# Altium schematic sheet Connectors.SchDoc
size A3; SheetNumber: 3; SheetTotal: 9
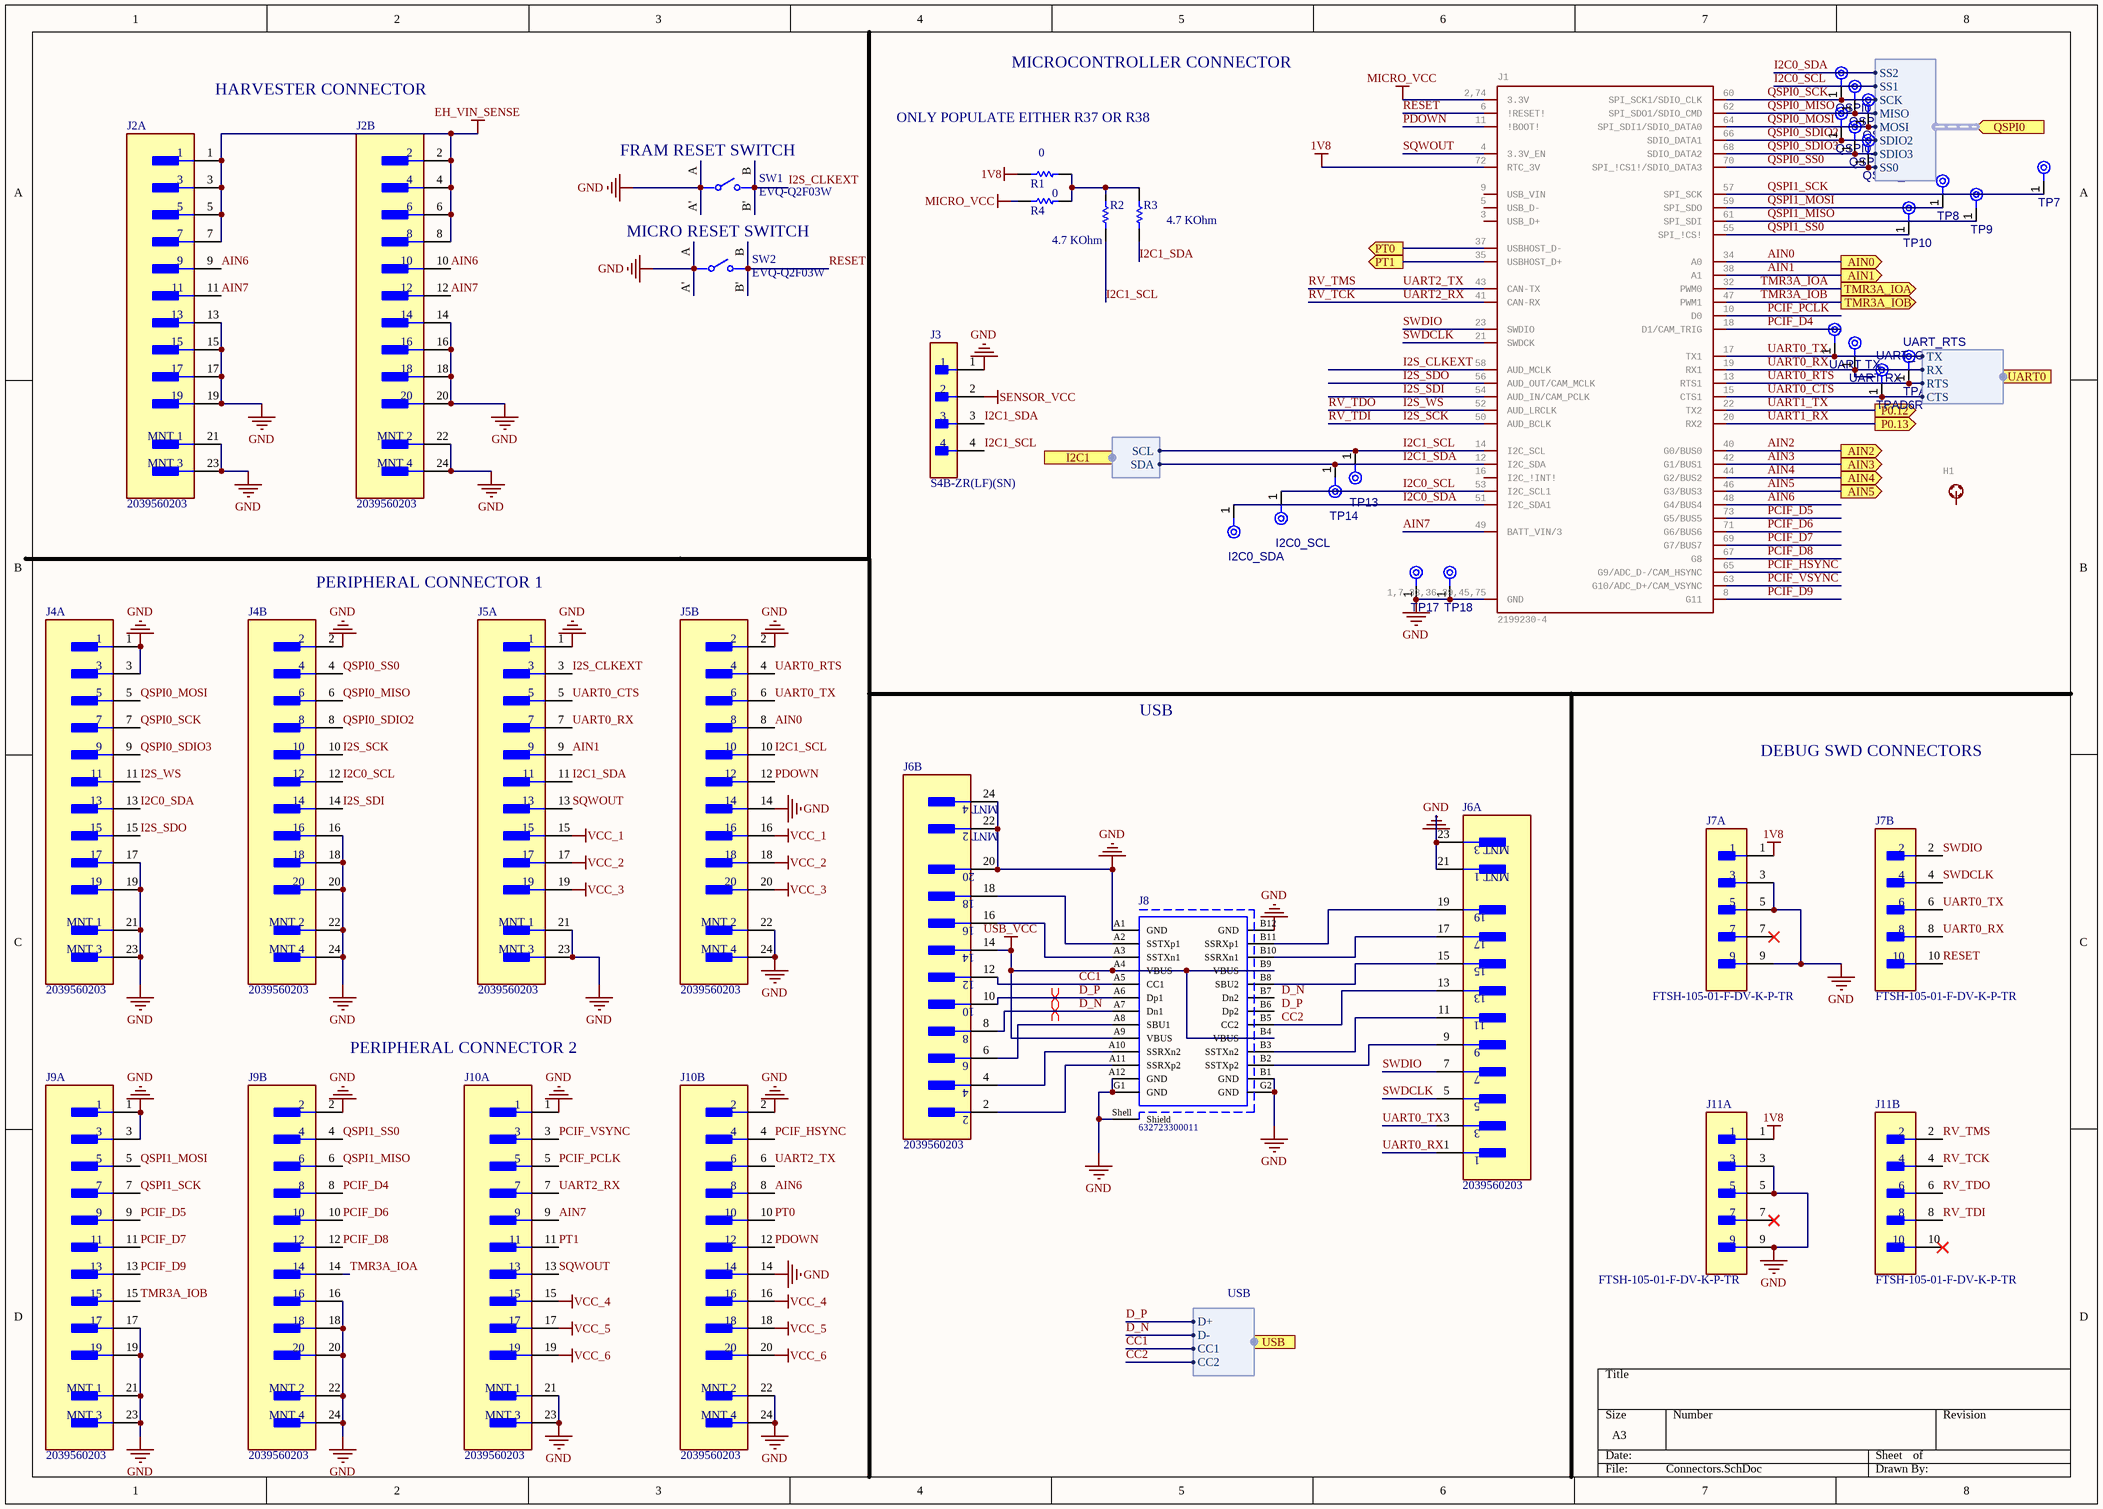
[diagram p0: Connectors.SchDoc]

## Parts
H1  9774025151R  [STAND-OFF-REFLOW-M2-5]  (value not drawn)
I2C0_SCL  TPAD6R  [TP06R]  (value not drawn)  (no BOM)
I2C0_SDA  TPAD6R  [TP06R]  (value not drawn)  (no BOM)
J1  2199230-4  [M-2-CONNECTOR-E]
J2  2039560203  [Molex_0_MFG]  (parts A,B of 2)
J3  S4B-ZR(LF)(SN)  [FP-S4B-ZR_LF_SN-MFG]
J4  2039560203  [Molex_0_MFG]  (parts A,B of 2)
J5  2039560203  [Molex_0_MFG]  (parts A,B of 2)
J6  2039560203  [Molex_0_MFG]  (parts A,B of 2)
J7  FTSH-105-01-F-DV-K-P-TR  [FP-FTSH-105-01-F-DV-K-P-T-MFG]  (parts A,B of 2)
J8  632723300011  [632723300011]
J9  2039560203  [Molex_0_MFG]  (parts A,B of 2)
J10  2039560203  [Molex_0_MFG]  (parts A,B of 2)
J11  FTSH-105-01-F-DV-K-P-TR  [FP-FTSH-105-01-F-DV-K-P-T-MFG]  (parts A,B of 2)
QSPI0_MISO  TPAD6R  [TP06R]  (value not drawn)  (no BOM)
QSPI0_MOSI  TPAD6R  [TP06R]  (value not drawn)  (no BOM)
QSPI0_SCK  TPAD6R  [TP06R]  (value not drawn)  (no BOM)
QSPI0_SDIO2  TPAD6R  [TP06R]  (value not drawn)  (no BOM)
QSPI0_SDIO3  TPAD6R  [TP06R]  (value not drawn)  (no BOM)
QSPI0_SS0  TPAD6R  [TP06R]  (value not drawn)  (no BOM)
R1  Resistance: 0  [RESC1005X40X25NL05T10]  (hidden comment: RC0402JR-070RL)
R2  Resistance: 4.7 KOhm  [RESC1005X40X25ML05T05]  (hidden comment: RMCF0402JT4K70)
R3  Resistance: 4.7 KOhm  [RESC1005X40X25ML05T05]  (hidden comment: RMCF0402JT4K70)
R4  Resistance: 0  [RESC1005X40X25NL05T10]  (hidden comment: RC0402JR-070RL)
SW1  EVQ-Q2F03W  [FP-EVQ-Q2F03W-MFG]
SW2  EVQ-Q2F03W  [FP-EVQ-Q2F03W-MFG]
TP7  TPAD6R  [TP06R]  (value not drawn)  (no BOM)
TP8  TPAD6R  [TP06R]  (value not drawn)  (no BOM)
TP9  TPAD6R  [TP06R]  (value not drawn)  (no BOM)
TP10  TPAD6R  [TP06R]  (value not drawn)  (no BOM)
TP13  TPAD6R  [TP06R]  (value not drawn)  (no BOM)
TP14  TPAD6R  [TP06R]  (value not drawn)  (no BOM)
TP17  TPAD6R  [TP06R]  (value not drawn)  (no BOM)
TP18  TPAD6R  [TP06R]  (value not drawn)  (no BOM)
UART_CTS  TPAD6R  [TP06R]  (no BOM)
UART_RTS  TPAD6R  [TP06R]  (no BOM)
UART_RX  TPAD6R  [TP06R]  (value not drawn)  (no BOM)
UART_TX  TPAD6R  [TP06R]  (value not drawn)  (no BOM)

## Ports
AIN0 (out), AIN1 (out), AIN2 (out), AIN3 (out), AIN4 (out), AIN5 (out), I2C1 (in, harness I2C1), P0.12 (out), P0.13 (out), PT0 (out), PT1 (out), QSPI0 (in, harness QSPI0), TMR3A_IOA (out), TMR3A_IOB (out), UART0 (out, harness *), USB (out, harness USB)

## Harnesses
QSPI0: SCK, MISO, MOSI, SDIO2, SDIO3, SS0, SS1, SS2
I2C1: SCL, SDA
*: TX, RX, RTS, CTS
USB: D+, D-, CC1, CC2

## Nets
1V8: J1.72(RTC_3V) J7.1 J11.1 R1.1
EH_VIN_SENSE: J2.1 J2.2 J2.3 J2.4 J2.5 J2.6 J2.7 J2.8
GND: J1.1,7,33,36,39,45,75(GND) J2.13 J2.14 J2.15 J2.16 J2.17 J2.18 J2.19 J2.20 J2.21(MNT_1) J2.22(MNT_2) J2.23(MNT_3) J2.24(MNT_4) J3.1 J4.1 J4.2 J4.3 J4.16 J4.17 J4.18 J4.19 J4.20 J4.21(MNT_1) J4.22(MNT_2) J4.23(MNT_3) J4.24(MNT_4) J5.1 J5.2 J5.14 J5.21(MNT_1) J5.22(MNT_2) J5.23(MNT_3) J5.24(MNT_4) J6.20 J6.21(MNT_1) J6.22(MNT_2) J6.23(MNT_3) J6.24(MNT_4) J7.3 J7.5 J7.9 J8.A1(GND) J8.A12(GND) J8.B1(GND) J8.B12(GND) J8.G1(GND) J8.G2(GND) J8.Shell(Shield) J9.1 J9.2 J9.3 J9.16 J9.17 J9.18 J9.19 J9.20 J9.21(MNT_1) J9.22(MNT_2) J9.23(MNT_3) J9.24(MNT_4) J10.1 J10.2 J10.14 J10.21(MNT_1) J10.22(MNT_2) J10.23(MNT_3) J10.24(MNT_4) J11.3 J11.5 J11.9 SW1.A SW1.A' SW2.A SW2.A' TP17.1(TP) TP18.1(TP)
MICRO_VCC: J1.2,74(3.3V) R4.1
SENSOR_VCC: J3.2
USB_VCC: J6.14 J8.A4(VBUS) J8.A9(VBUS) J8.B4(VBUS) J8.B9(VBUS)
VCC_1: J5.15 J5.16
VCC_2: J5.17 J5.18
VCC_3: J5.19 J5.20
VCC_4: J10.15 J10.16
VCC_5: J10.17 J10.18
VCC_6: J10.19 J10.20
AIN0: J1.34(A0) J5.8 ; port AIN0
AIN1: J1.38(A1) J5.9 ; port AIN1
AIN2: J1.40(G0/BUS0) ; port AIN2
AIN3: J1.42(G1/BUS1) ; port AIN3
AIN4: J1.44(G2/BUS2) ; port AIN4
AIN5: J1.46(G3/BUS3) ; port AIN5
AIN6: J1.48(G4/BUS4) J2.9 J2.10 J10.8
AIN7: J1.49(BATT_VIN/3) J2.11 J2.12 J10.9
CC1: J6.12 J8.A5(CC1) ; port USB.CC1
CC2: J6.13 J8.B5(CC2) ; port USB.CC2
D_N: J6.8 J8.A7(Dn1) ; port USB.D-
D_P: J6.10 J8.A6(Dp1) ; port USB.D+
I2C0_SCL: I2C0_SCL.1(TP) J1.53(I2C_SCL1) J4.12 ; port QSPI0.SS1
I2C0_SDA: I2C0_SDA.1(TP) J1.51(I2C_SDA1) J4.13 ; port QSPI0.SS2
I2C1_SCL: J1.14(I2C_SCL) J3.4 J5.10 R2.1 TP13.1(TP) ; port I2C1.SCL
I2C1_SDA: J1.12(I2C_SDA) J3.3 J5.11 R3.1 TP14.1(TP) ; port I2C1.SDA
I2S_CLKEXT: J1.58(AUD_MCLK) J5.3 SW1.B SW1.B'
I2S_SCK: J1.50(AUD_BCLK) J4.10 J11.8  [also labelled RV_TDI]
I2S_SDI: J1.54(AUD_IN/CAM_PCLK) J4.14
I2S_SDO: J1.56(AUD_OUT/CAM_MCLK) J4.15
I2S_WS: J1.52(AUD_LRCLK) J4.11 J11.6  [also labelled RV_TDO]
PCIF_D4: J1.18(D1/CAM_TRIG) J9.8
PCIF_D5: J1.73(G5/BUS5) J9.9
PCIF_D6: J1.71(G6/BUS6) J9.10
PCIF_D7: J1.69(G7/BUS7) J9.11
PCIF_D8: J1.67(G8) J9.12
PCIF_D9: J1.8(G11) J9.13
PCIF_HSYNC: J1.65(G9/ADC_D-/CAM_HSYNC) J10.4
PCIF_PCLK: J1.10(D0) J10.5
PCIF_VSYNC: J1.63(G10/ADC_D+/CAM_VSYNC) J10.3
PDOWN: J1.11(!BOOT!) J5.12 J10.12
PT0: J10.10
PT0: J1.37(USBHOST_D-) ; port PT0  [a separate net that carries the same name]
PT1: J10.11
PT1: J1.35(USBHOST_D+) ; port PT1  [a separate net that carries the same name]
QSPI0_MISO: J1.62(SPI_SDO1/SDIO_CMD) J4.6 QSPI0_MISO.1(TP) ; port QSPI0.MISO
QSPI0_MOSI: J1.64(SPI_SDI1/SDIO_DATA0) J4.5 QSPI0_MOSI.1(TP) ; port QSPI0.MOSI
QSPI0_SCK: J1.60(SPI_SCK1/SDIO_CLK) J4.7 QSPI0_SCK.1(TP) ; port QSPI0.SCK
QSPI0_SDIO2: J1.66(SDIO_DATA1) J4.8 QSPI0_SDIO2.1(TP) ; port QSPI0.SDIO2
QSPI0_SDIO3: J1.68(SDIO_DATA2) J4.9 QSPI0_SDIO3.1(TP) ; port QSPI0.SDIO3
QSPI0_SS0: J1.70(SPI_!CS1!/SDIO_DATA3) J4.4 QSPI0_SS0.1(TP) ; port QSPI0.SS0
QSPI1_MISO: J1.61(SPI_SDI) J9.6 TP9.1(TP)
QSPI1_MOSI: J1.59(SPI_SDO) J9.5 TP8.1(TP)
QSPI1_SCK: J1.57(SPI_SCK) J9.7 TP7.1(TP)
QSPI1_SS0: J1.55(SPI_!CS!) J9.4 TP10.1(TP)
RESET: J1.6(!RESET!) J7.10 SW2.B SW2.B'
RV_TCK: J1.41(CAN-RX) J10.7 J11.4  [also labelled UART2_RX]
RV_TMS: J1.43(CAN-TX) J10.6 J11.2  [also labelled UART2_TX]
SQWOUT: J1.4(3.3V_EN) J5.13 J10.13
SWDCLK: J1.21(SWDCK) J6.5 J7.4
SWDIO: J1.23(SWDIO) J6.7 J7.2
TMR3A_IOA: J1.32(PWM0) J9.14 ; port TMR3A_IOA
TMR3A_IOB: J1.47(PWM1) J9.15 ; port TMR3A_IOB
UART0_CTS: J1.15(CTS1) J5.5 UART_CTS.1(TP) ; port UART0.CTS
UART0_RTS: J1.13(RTS1) J5.4 UART_RTS.1(TP) ; port UART0.RTS
UART0_RX: J1.19(RX1) J5.7 J6.1 J7.8 UART_RX.1(TP) ; port UART0.RX
UART0_TX: J1.17(TX1) J5.6 J6.3 J7.6 UART_TX.1(TP) ; port UART0.TX
UART1_RX: J1.20(RX2) ; port P0.13
UART1_TX: J1.22(TX2) ; port P0.12
NetJ6_2: J6.2 J8.A11(SSRXp2)
NetJ6_4: J6.4 J8.A10(SSRXn2)
NetJ6_6: J6.6 J8.A8(SBU1)
NetJ6_9: J6.9 J8.B2(SSTXp2)
NetJ6_11: J6.11 J8.B3(SSTXn2)
NetJ6_15: J6.15 J8.B8(SBU2)
NetJ6_16: J6.16 J8.A3(SSTXn1)
NetJ6_17: J6.17 J8.B10(SSRXn1)
NetJ6_18: J6.18 J8.A2(SSTXp1)
NetJ6_19: J6.19 J8.B11(SSRXp1)
NetR1_2: R1.2 R2.2 R3.2 R4.2

Not connected (* = marked no-connect by the designer): H1 1; J1 3(USB_D+) 5(USB_D-) 9(USB_VIN) 16(I2C_!INT!); J7 7*; J8 B6(Dp2) B7(Dn2); J11 7* 10*

## Layout directives
differential pair: D_N, D_P

## Notes on the sheet
- HARVESTER CONNECTOR
- MICROCONTROLLER CONNECTOR
- (near SW1) FRAM RESET SWITCH
- ONLY POPULATE EITHER R37 OR R38
- MICRO RESET SWITCH
- PERIPHERAL CONNECTOR 1
- USB
- DEBUG SWD CONNECTORS
- PERIPHERAL CONNECTOR 2
- Labels drawn without touching a wire or pin: D_N, D_P

## Library data of the parts
H1 = STAND-OFF-REFLOW2.5MM_TALL: GateName_1: G$1; PROD_ID: HW-14899; SymbolName_1: STAND-OFF-REFLOW; DeviceName: 2.5MM_TALL; LibraryName: SparkFun-Hardware; DeviceSetName: STAND-OFF-REFLOW; Package: STAND-OFF-REFLOW-M2.5
I2C0_SCL I2C0_SDA QSPI0_MISO QSPI0_MOSI QSPI0_SCK QSPI0_SDIO2 QSPI0_SDIO3 QSPI0_SS0 TP7-TP10 TP13 TP14 TP17 TP18 UART_CTS UART_RTS UART_RX UART_TX = CMP-00028-00002-2: 0.6mm round; Pins: 1
J1 = MICROMOD-2222-C: GateName_1: J1; PROD_ID: CONN-14877; SymbolName_1: MICROMOD; DeviceName: -2222-C; LibraryName: SparkFun-MicroMod; DeviceSetName: MICROMOD; Package: M.2-CONNECTOR-E
J2 J4-J6 J9 J10 = CMP-003-000000-1: 20 Position Connector Plug, Outer Shroud Contacts Surface Mount Gold; Manufacturer: Molex; Number Of Contacts: 20; Voltage Rating: 40V; Is Female: no; Symbol Hash: db22f1623fbfed54a22177e49599976dea34d6b12f98f445fc170047d3fb1d12; Conn Gender: Male; Verification Version: 0.0.0.3; Pitch: 0.4mm; Conn Orientation: Vertical; Current Rating: 0.3A; RoHS: TRUE; Digikey Description: CONN PLUG 20POS SMD GOLD; Automotive: No; Temperature Range High: +125°C; Temperature: -40°C to +125°C; Digikey Part Number: 900-2039560203CT-ND; Part Number: 2039560203; Footprint Url: https://www.molex.com/pdm_docs/sd/2039560203_sd.pdf; Lead Free: Yes; ComponentLink1URL: https://upverter.com/part/id/0a58283e91808ac4/; ComponentLink2URL: https://www.molex.com/webdocs/datasheets/pdf/en-us/2039560203_PCB_HEADERS.pdf; Contact Material: Gold,Nickel; Package: 0; Mouser Part Number: 538-203956-0203; Height: 4.55mm; Datasheet Path: datasheets/Conn_Molex_2039560203_eec.pdf; Number Of Rows: 2; ComponentLink1Description: Upverter; Temperature Range Low: -40°C; helpURL: https://upverter.com/part/id/0a58283e91808ac4/; ComponentLink2Description: Datasheet
J3 = CMP-17439-000004-1: CONN HEADER R/A 4POS 1.5MM; Manufacturer: JST; Conn Gender: Male; Conn Orientation: Right Angle; Number Of Contacts: 4; Voltage Rating: 50V; Current Rating: 1A; Device Class L3: unset; Number Of Rows: 1; Category: Conn; ComponentLink2URL: http://www.jst-mfg.com/product/pdf/eng/eZH.pdf; Height: 3.7mm; Pitch: 1.5mm; Device Class L1: Connectors; Octopart: https://octopart.com/s4b-zr%28lf%29%28sn%29-jst-248835; Package: S4B-ZR(LF)(SN); Temperature: -25°C to +85°C; Digikey Description: CONN HEADER R/A 4POS 1.5MM; Contact Material: Tin; Manufacturer Part Number: S4B-ZR(LF)(SN); Temperature Range High: +85°C; Automotive: No; Temperature Range Low: -25°C; Lead Free: Yes; RoHS: TRUE; ComponentLink2Description: Datasheet; Device Class L2: Headers and Wire Housings
J7 J11 = CMP-02766-000120-1: CONN HEADER SMD 10POS 1.27MM; Number of Contacts: 10; Row Spacing: 0.05inch; Connector Type: Male Pin; Contact Plating: Gold; Housing Material: Polymer; Length: 6.35mm; Number of Rows: 2; Min Operating Temperature: -55°C; Pitch: 1.27mm; Termination: Solder; Package Quantity: 500; Lead Free: Lead Free; Radiation Hardening: No; Number of Positions: 10; Orientation: Straight; Contact Material: Bronze; Packaging: Tape and Reel; Depth: 5.84mm; Contact Mating Length: 0.12inch; Housing Color: Black; Mount: Surface Mount; Color: Black; Max Operating Temperature: 125°C
J8 = CMP-1502-03214-1: USB 3.1 Type C Receptacle WR-COM, Horizontal, SMT / THT; Manufacturer: Wurth Elektronik; Rated Current: 5A; Contact Resistance: 30mOhm; Working Voltage: 20VDC; Operating Temperature: -40to105degC; Package Reference: 632723300011; Datasheet URL: https://katalog.we-online.de/em/datasheet/632723x00011%282%29.pdf; Manufacturer URL: http://www.we-online.de; Connector Type: USB3.1TypeC; Gender: Receptacle; Part Number: 632723300011; Mounting Technology: SMT/THT; Publisher: WurthElektronik; Packaging: TapeandReel; Orientation: Horizontal
R1 R4 = CMP-1011-00001-2: Manufacturer: Yageo / Phycomp; Part Number: RC0402JR-070RL
R2 R3 = CMP-2002-01154-4: Chip Resistor, 4.7 KOhm, +/- 1%, 0.1 W, -55 to 155 degC, 0402 (1005 Metric), RoHS, Tape and Reel; PartNumber: ERJ-2RKF4701X; Voltage Rating: 50 V; Case\/Package: 0402; Power Rating: 100 mW; Height: 0.35 mm; Mounting Technology: Surface Mount; REACH SVHC: Yes; Max Operating Temperature: 155 degC; ComponentLink1Description: Manufacturer URL; ComponentLink2Description: Datasheet; Pins: 2; PackageReference: 0402; Tolerance: 1%; Case Code (Imperial): 0402; Length: 1 mm; PackageDescription: 2-Pin Surface Mount Device, Body 1 x 0.5 mm; RoHSCompliant: true; Package Quantity: 1; Radiation Hardening: No; DatasheetVersion: 04/2015; Width: 0.5 mm; Case Code (Metric): 1005; Mount: Surface Mount; ComponentLink1URL: http://www.panasonic.com/; Min Operating Temperature: -55 degC; Packaging: Cut Tape; ComponentLink2URL: http://industrial.panasonic.com/cdbs/www-data/pdf/RDA0000/AOA0000C86.pdf
SW1 SW2 = CMP-05618-000127-1: SWITCH TACTILE SPST-NO 0.02A 15V; Body Depth: 6mm; Illumination Type: Non-Illuminated; Mechanical Life: 1000000Cycles; Switch Travel: 0.2mm; Actuator Length: 1.3mm; Max Voltage Rating (AC): 250V; Contact Resistance: 100mR; Operating Force: 1N; Current Rating: 20mA; Switch Function: Off-Mom; Actuator Color: White; Number of Poles: 1; Throw Configuration: SPST; Actuator Type: Standard; Contact Plating: Gold; Lead Free: Lead Free; Package Quantity: 1; Radiation Hardening: No; Depth: 6.6mm; Termination: SMD/SMT; Voltage Rating (AC): 250V; Size: 1.8mm; Thickness: 1.8mm; Height: 3.1mm; Mount: Surface Mount; Contact Current Rating: 20mA; Color: White; Width: 6.5mm; Series: EVQQ2; Max Operating Temperature: 85°C; Min Operating Temperature: -40°C; Packaging: Tape and Reel; Voltage Rating (DC): 15V; RoHS Compliant: Yes; Length: 6mm; Max Voltage Rating (DC): 15V; Max Current Rating: 20mA; Case/Package: SMD/SMT; Orientation: Straight; Electrical Life: 1000000Cycles